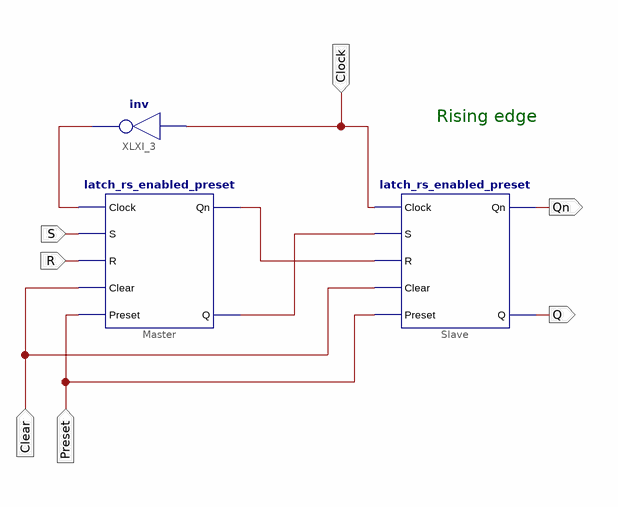
[diagram p0: schematic sheet 1]
// Xilinx ISE schematic RS_Preset_MS.sch (spartan3e) as structural Verilog: 3 symbols, 7 ports
module RS_Preset_MS (
  input  Clock,
  input  Clear,
  input  Preset,
  input  S,
  input  R,
  output Qn,
  output Q
);

  wire XLXN_1, XLXN_14, XLXN_15;

  latch_rs_enabled_preset Master (
    .Clock(XLXN_1), .S(S), .R(R), .Clear(Clear), .Preset(Preset), .Qn(XLXN_14), .Q(XLXN_15));
  latch_rs_enabled_preset Slave (
    .Clock(Clock), .S(XLXN_15), .R(XLXN_14), .Clear(Clear), .Preset(Preset), .Qn(Qn), .Q(Q));
  not XLXI_3 (XLXN_1, Clock);

  // Notes on the sheet:
  //   Rising edge
endmodule
